# Altium schematic sheet motor_drive.SchDoc: Robot Control PCB
size A4; Revision: 0.1; SheetNumber: 3; SheetTotal: 5; DrawnBy: OYSM; ProjectNumber: 1; DocumentSize: A4; PCAName: robot_control_pcb
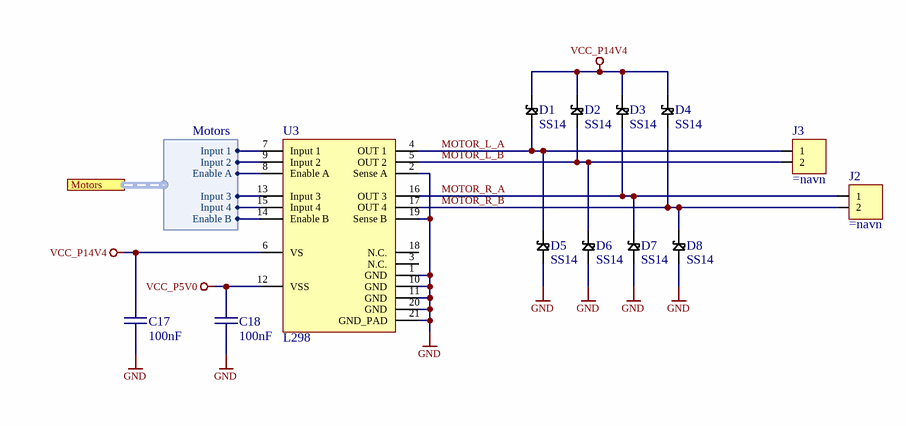
[diagram p0: motor_drive.SchDoc]

## Parts
C17  100nF  [CAPC0603(1608)55_N]
C18  100nF  [CAPC0603(1608)55_N]
D1  SS14  [SMA_DO-214AC]
D2  SS14  [SMA_DO-214AC]
D3  SS14  [SMA_DO-214AC]
D4  SS14  [SMA_DO-214AC]
D5  SS14  [SMA_DO-214AC]
D6  SS14  [SMA_DO-214AC]
D7  SS14  [SMA_DO-214AC]
D8  SS14  [SMA_DO-214AC]
J2  (no value)  [XT30_Female_Vertical]
J3  (no value)  [XT30_Female_Vertical]
U3  L298  [SOIC127P1420X360_HS-21M]

## Ports
Motors (harness Motors)

## Harnesses
Motors: Input 1, Input 2, Input 3, Input 4, Enable A, Enable B

## Nets
GND: C17.1 C18.1 D5.1(A) D6.1(A) D7.1(A) D8.1(A) U3.1(GND) U3.2(Sense_A) U3.10(GND) U3.11(GND) U3.19(Sense_B) U3.20(GND) U3.21(GND_PAD)
VCC_P5V0: C18.2 U3.12(VSS)
VCC_P14V4: C17.2 D1.2(K) D2.2(K) D3.2(K) D4.2(K) U3.6(VS)
MOTOR_L_A: D1.1(A) D5.2(K) J3.1 U3.4(OUT_1)
MOTOR_L_B: D2.1(A) D6.2(K) J3.2 U3.5(OUT_2)
MOTOR_R_A: D3.1(A) D7.2(K) J2.1 U3.16(OUT_3)
MOTOR_R_B: D4.1(A) D8.2(K) J2.2 U3.17(OUT_4)
NetU3_7: U3.7(Input_1) ; port Motors.Input 1
NetU3_8: U3.8(Enable_A) ; port Motors.Enable A
NetU3_9: U3.9(Input_2) ; port Motors.Input 2
NetU3_13: U3.13(Input_3) ; port Motors.Input 3
NetU3_14: U3.14(Enable_B) ; port Motors.Enable B
NetU3_15: U3.15(Input_4) ; port Motors.Input 4

Not connected (* = marked no-connect by the designer): U3 3(N.C.) 18(N.C.)

## Notes on the sheet
- Title
- Size
- Date:
- A4
- Project Number
- Sheet         of
- Revision
- File:
- Drawn By:

## Library data of the parts
C17 C18 = 5152: X7R 50V 5%; id: 5152; rad: 21; rom: OV; lager_type: Baklager; dybde: 0; antall: 1000; pakke_opprettet_av: 815; leverandor_varenr: 1759122; pris: 1; nokkelord: Kondensator, Capacitor, CAP; produsent: Multikomp; leverandor: Farnell; pakketype: 0603; komponenttype: 2; hylle: 0; pakke_opprettet: 2015-02-18 14:18:13; symbol_opprettet_av: 815; symbol_opprettet: 2014-11-14 20:19:34; navn: 100nF
D1-D8 = 5642: id: 5642; pakke_opprettet_av: 815; beskrivelse: SS14-E3/61T - Schottky Rectifier, 40 V, 1 A, Single, DO-214AC, 2 Pins, 500 mV; leverandor_varenr: 9551280; pris: 4; nokkelord: Diode; produsent: Vishay; leverandor: Farnell; pakketype: DO; komponenttype: 9; pakke_opprettet: 19/01/2020 14:48:44; symbol_opprettet_av: 815; symbol_opprettet: 28/06/2014 15:20:09; navn: SS14
J2 J3 = 4550: Pris per del, For å koble ledninger sammen; id: 4550
U3 = 5620: Dual H Bridge; id: 5620; pakke_opprettet_av: 815; leverandor_varenr: 2762686; pris: 84; nokkelord: h-bro, h-bridge, driver, motor driver, motordriver, l298n; produsent: ST; leverandor: Farnell; pakketype: SMD; komponenttype: 15; pakke_opprettet: 18.01.2020 20:43:17; symbol_opprettet_av: 815; symbol_opprettet: 18.01.2020 20:24:51; navn: L298